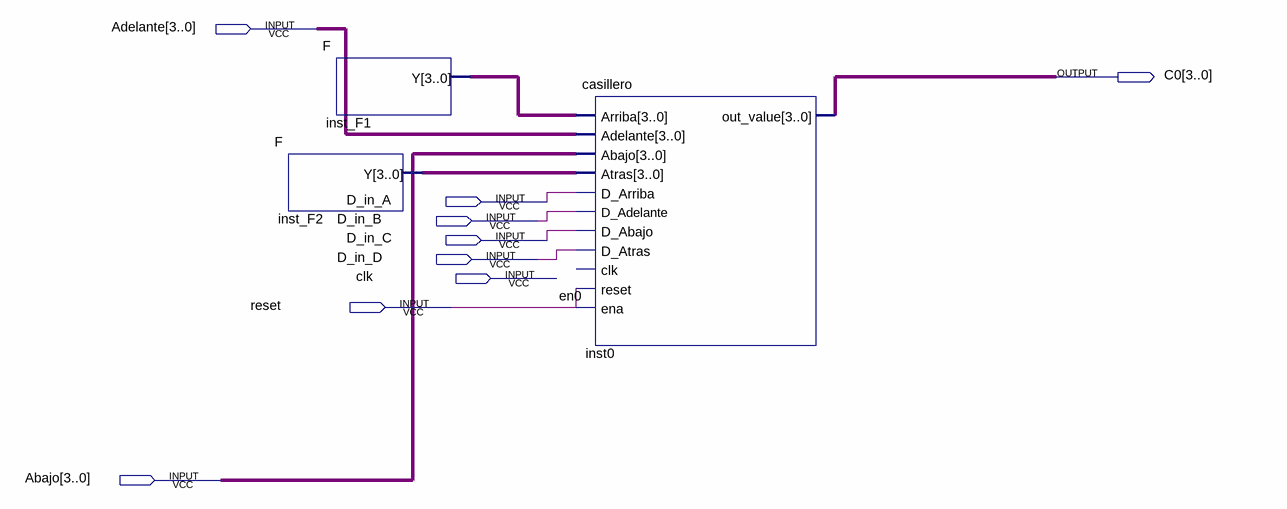
[diagram p0: schematic sheet]
// Quartus schematic matriz_prupru.bdf as structural Verilog: 3 symbols, 9 pins
module matriz_prupru (
  input  [3:0] Adelante,
  input  D_in_A,
  input  D_in_B,
  input  D_in_C,
  input  D_in_D,
  input  clk,
  input  reset,
  input  [3:0] Abajo,
  output [3:0] C0
);

  wire [3:0] inst_F1_y, inst_F2_y;

  F inst_F2 (.Y(inst_F2_y));
  F inst_F1 (.Y(inst_F1_y));
  casillero inst0 (
    .Arriba(inst_F1_y), .Adelante(Adelante), .Abajo(Abajo), .Atras(inst_F2_y), .D_Arriba(D_in_A),
    .D_Adelante(D_in_B), .D_Abajo(D_in_C), .D_Atras(D_in_D), .reset(reset), .ena(reset), .out_value(C0));  // open: clk

  // Other names for the same wires on the sheet: en0 = reset
endmodule
